# EAGLE design C2N-PowerV2 (EAGLE 5.11)
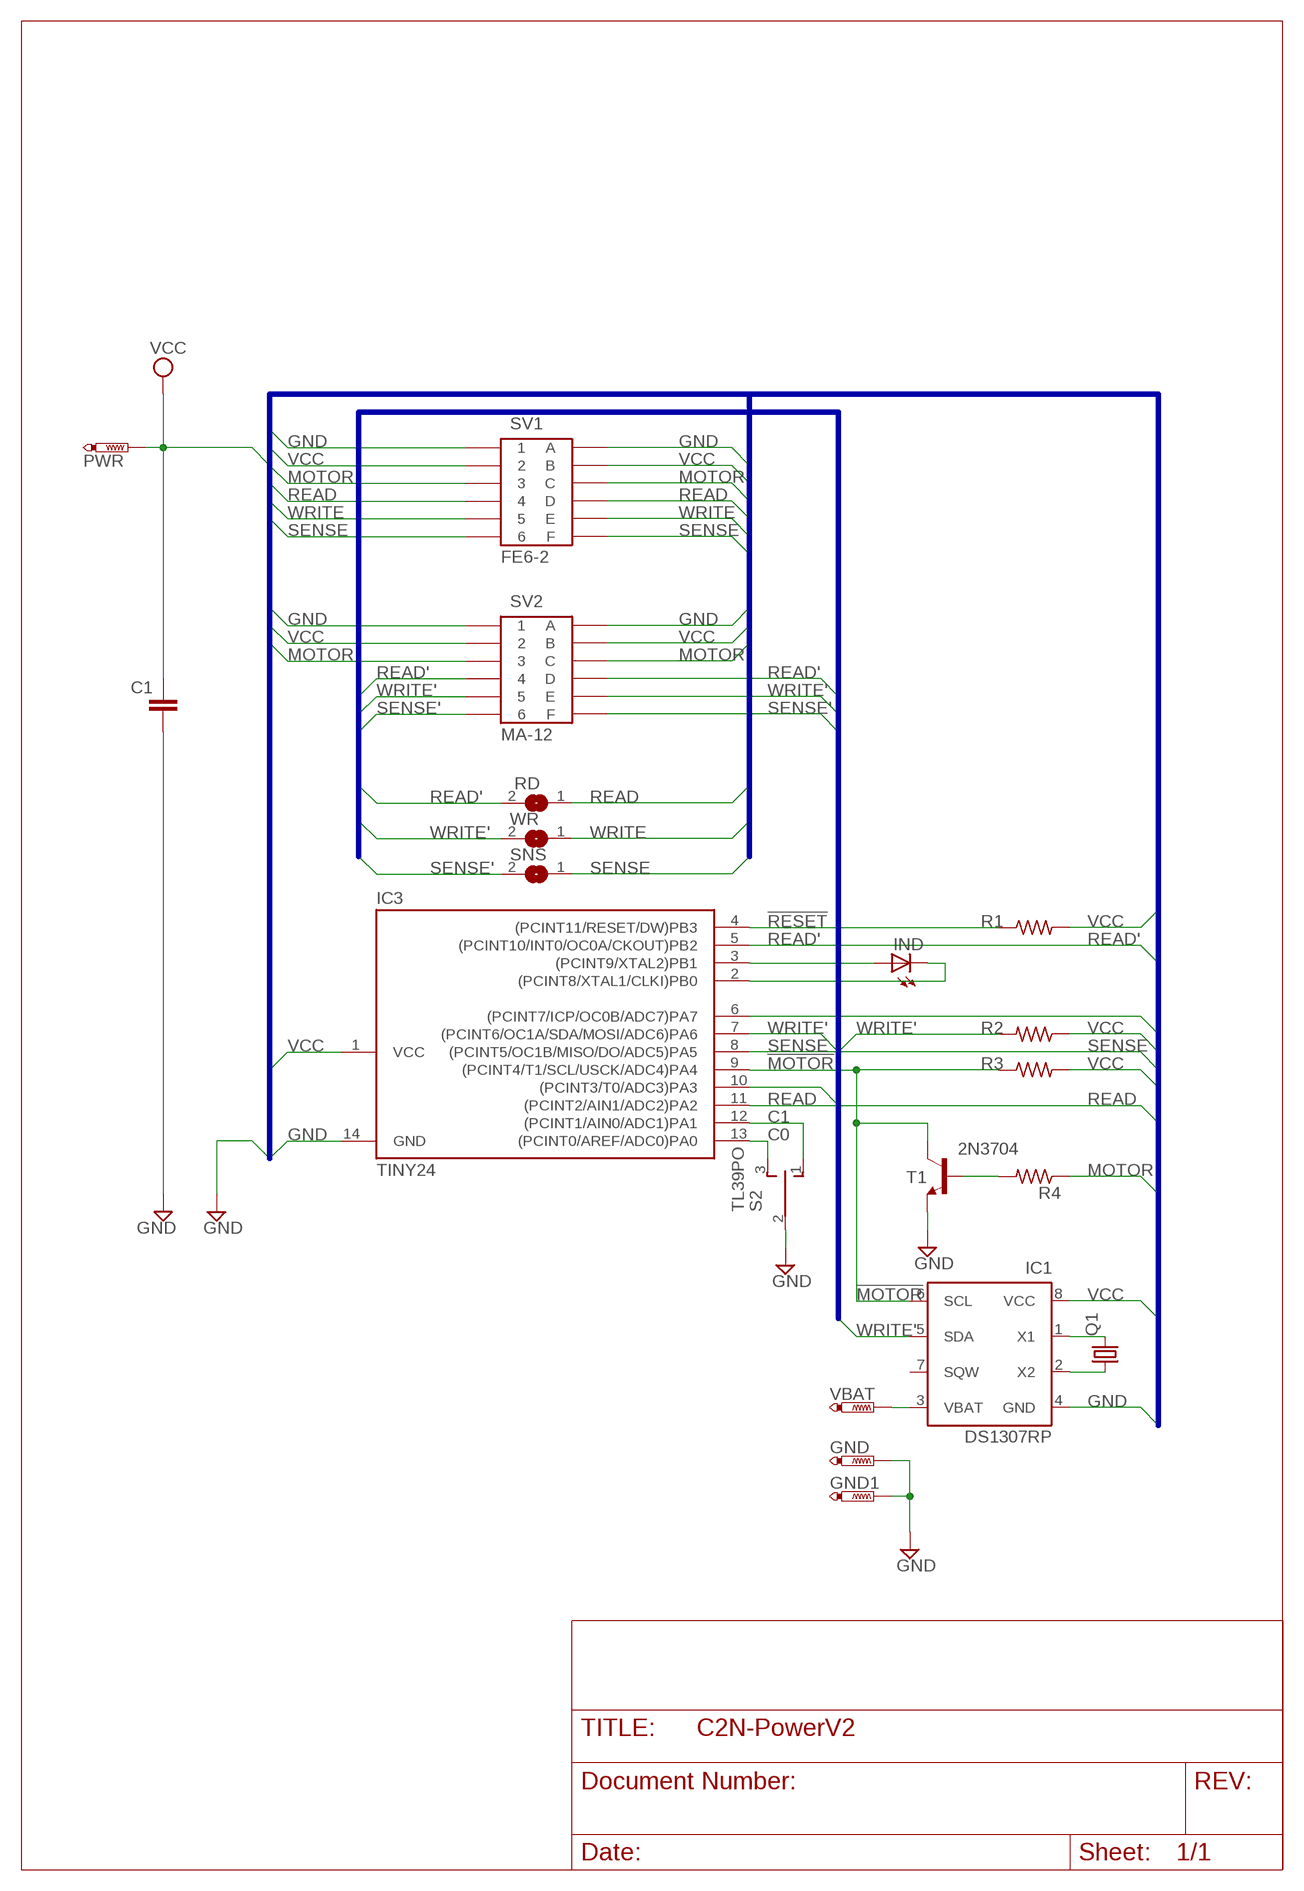
[diagram p0: schematic, sheet 1]

## Parts
C1  C2.5/2  [C2.5-2]
GND  PTR1TP10R  [TP10R]
GND1  PTR1TP10R  [TP10R]
IC1  DS1307RP  [DIL08-RP]
IC3  TINY24  TINY24/44/84-PU  [DIL14]
IND  LED3MM  [LED3MM]
PWR  PTR1PAD1-13  [P1-13]
Q1  CRYSTALTC26V  [TC26V]
R1  R-US_0204/2V  [0204V]
R2  R-US_0204/2V  [0204V]
R3  R-US_0204/2V  [0204V]
R4  R-US_0204/2V  [0204V]
RD  SJ  [SJ]
S2  TL39PO  [TL3XPO]
SNS  SJ  [SJ]
SV1  FE6-2  [FE6-2_SHORT]
SV2  MA-12  [MA-12]
T1  2N3704  [TO92]
VBAT  PTR1TP10R  [TP10R]
WR  SJ  [SJ]

## Nets
!MOTOR: IC1.6(SCL) IC3.9((PCINT4/T1/SCL/USCK/ADC4)PA4) R3.1 T1.2(C)
!RESET: IC3.4((PCINT11/RESET/DW)PB3) R1.1
C0: IC3.13((PCINT0/AREF/ADC0)PA0) S2.3(S)
C1: IC3.12((PCINT1/AIN0/ADC1)PA1) S2.1(O)
GND: C1.2 GND1.TP GND.TP IC1.4(GND) IC3.14(GND) S2.2(P) SV1.1 SV1.A SV2.1 SV2.A T1.3(E)
MOTOR: R4.1 SV1.3 SV1.C SV2.3 SV2.C
N$1: IC3.3((PCINT9/XTAL2)PB1) IND.A
N$3: IC3.2((PCINT8/XTAL1/CLKI)PB0) IND.K(C)
N$8: IC1.1(X1) Q1.2
N$9: IC1.2(X2) Q1.1
N$10: R4.2 T1.1(B)
READ: IC3.11((PCINT2/AIN1/ADC2)PA2) RD.1 SV1.4 SV1.D
READ': IC3.5((PCINT10/INT0/OC0A/CKOUT)PB2) RD.2 SV2.4 SV2.D
SENSE: IC3.8((PCINT5/OC1B/MISO/DO/ADC5)PA5) SNS.1 SV1.6 SV1.F
SENSE': IC3.10((PCINT3/T0/ADC3)PA3) SNS.2 SV2.6 SV2.F
VBAT: IC1.3(VBAT) VBAT.TP
VCC: C1.1 IC1.8(VCC) IC3.1(VCC) PWR.TP R1.2 R2.1 R3.2 SV1.2 SV1.B SV2.2 SV2.B
WRITE: IC3.6((PCINT7/ICP/OC0B/ADC7)PA7) SV1.5 SV1.E WR.1
WRITE': IC1.5(SDA) IC3.7((PCINT6/OC1A/SDA/MOSI/ADC6)PA6) R2.2 SV2.5 SV2.E WR.2
Unconnected: IC1.7(SQW)

## Buses
GND,VCC,MOTOR,SENSE,READ,WRITE
READ',WRITE',SENSE'

## Library data of the parts
C1 = capacitor-wima:C: CAPACITOR naming: grid - package width
GND GND1 PWR VBAT = testpad:PTR1: TEST PIN
IC1 = ds1307_pcf8583:DS1307: I2C-Bus CLOCK/CALENDAR
IC3 = avr-roundpad:TINY24/44/84
IND = led:LED: LED OSRAM: - CHIPLED LG R971, LG N971, LY N971, LG Q971, LY Q971, LO R971, LY R971 LH N974, LH R974 LS Q976, LO Q976, LY Q976 LO Q996 - Hyper CHIPLED LW Q18S LB Q993, LB Q99A, LB R99A - SideLED LS A670, LO A670, LY A670, LG A670, LP A670 LB A673, LV A673, LT A673, LW A673 LH A674 LY A675 LS A676, LA A676, LO A676, LY A676, LW A676 LS A679, LY A679, LG A679 - Hyper Micro SIDELED® LS Y876, LA Y876, LO Y876, LY Y876 LT Y87S - SmartLED LW L88C, LW L88S LB L89C, LB L89S, LG L890 LS L89K, LO L89K, LY L89K LS L896, LA L896, LO L896, LY L896 - TOPLED LS T670, LO T670, LY T670, LG T670, LP T670 LSG T670, LSP T670, LSY T670, LOP T670, LYG T670 LG T671, LOG T671, LSG T671 LB T673, LV T673, LT T673, LW T673 LH T674 LS T676, LA T676, LO T676, LY T676, LB T676, LH T676, LSB T676, LW T676 LB T67C, LV T67C, LT T67C, LS T67K, LO T67K, LY T67K, LW E67C LS E67B, LA E67B, LO E67B, LY E67B, LB E67C, LV E67C, LT E67C LW T67C LS T679, LY T679, LG T679 LS T770, LO T770, LY T770, LG T770, LP T770 LB T773, LV T773, LT T773, LW T773 LH T774 LS E675, LA E675, LY E675, LS T675 LS T776, LA T776, LO T776, LY T776, LB T776 LHGB T686 LT T68C, LB T68C - Hyper Mini TOPLED® LB M676 - Mini TOPLED Santana® LG M470 LS M47K, LO M47K, LY M47K Source: http://www.osram.convergy.de LUXEON: - LUMILED® LXK2-PW12-R00, LXK2-PW12-S00, LXK2-PW14-U00, LXK2-PW14-V00 LXK2-PM12-R00, LXK2-PM12-S00, LXK2-PM14-U00 LXK2-PE12-Q00, LXK2-PE12-R00, LXK2-PE12-S00, LXK2-PE14-T00, LXK2-PE14-U00 LXK2-PB12-K00, LXK2-PB12-L00, LXK2-PB12-M00, LXK2-PB14-N00, LXK2-PB14-P00, LXK2-PB14-Q00 LXK2-PR12-L00, LXK2-PR12-M00, LXK2-PR14-Q00, LXK2-PR14-R00 LXK2-PD12-Q00, LXK2-PD12-R00, LXK2-PD12-S00 LXK2-PH12-R00, LXK2-PH12-S00 LXK2-PL12-P00, LXK2-PL12-Q00, LXK2-PL12-R00 Source: www.luxeon.com KINGBRIGHT: KA-3528ASYC Source: www.kingbright.com
Q1 = crystal:CRYSTAL: CRYSTAL; OC_FARNELL: unknown; OC_NEWARK: unknown
R1-R4 = rcl:R-US_: RESISTOR, American symbol
RD SNS WR = jumper:SJ: SMD solder JUMPER
S2 = switch:TL39PO: TINY SWITCH ON OFF ON Source: http://www2.produktinfo.conrad.com/datenblaetter/700000-724999/705152-da-01-de-Subminiaturschalter_TL_36YO.pdf
SV1 = con-edge-156:FE6-2
SV2 = con-edge-156:MA-12
T1 = transistor:2N3704: NPN TRANSISTOR

## Board
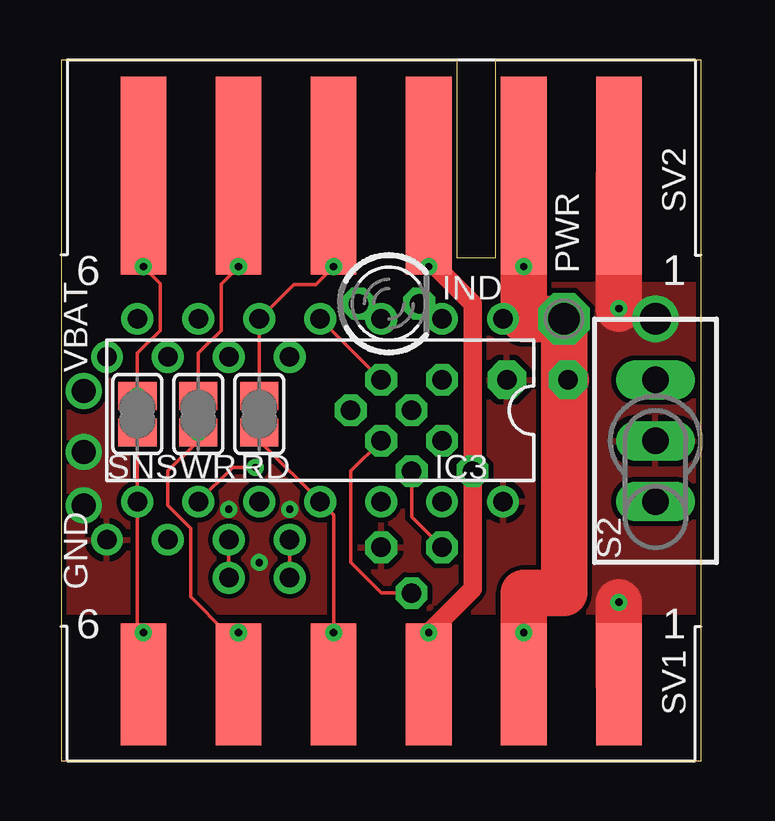
[diagram p1: board, top side]
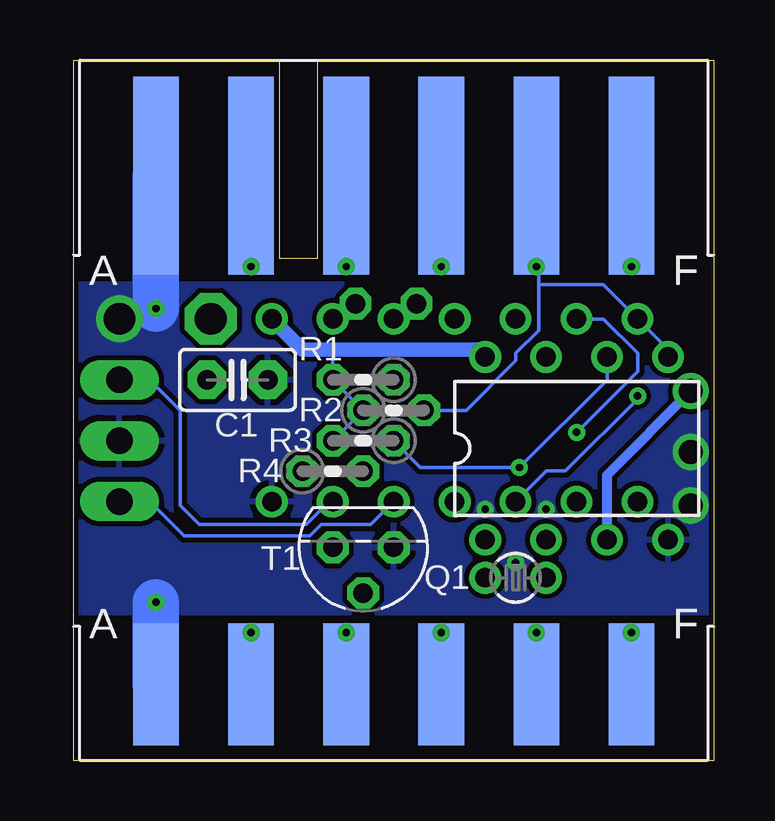
[diagram p2: board, bottom side, seen from below]

Size 26.67 x 29.21 mm. Coordinates in mm from the lower left corner, seen from the top.
Outline: 26.67,0 26.67,29.21 18.1,29.21 18.1,20.95 16.51,20.95 16.51,29.21 0,29.21 0.01,0 26.67,0
Copper layers (1*16): Top 0.035mm / dielectric 1.5mm / Bottom 0.035mm
Design rules "default *": minimum track width 4mil, minimum drill 12mil, track to track 8mil, track to pad 8mil, pad to pad 8mil, via to via 8mil, smd to smd 8mil, copper to edge 8mil, drill to drill 8mil, minimum pad ring 10mil, minimum via ring 8mil, stop-mask expansion 4mil, vias tented up to drill 0mil, thermal gap 10mil

### Footprints (pad centres in the part's own frame; a part is rotated, then mirrored left to right if it is on the bottom)
C2.5-2 = drill 0.813 pad 1.6 octagon: 1 -1.27,0; 2 1.27,0
TP10R = smd 1 x 1: TP 0,0
DIL08-RP = drill 0.813 round: 1 -3.81,-3.81; 2 -1.27,-3.81; 3 1.27,-3.81; 4 3.81,-3.81; 5 3.81,3.81; 6 1.27,3.81; 7 -1.27,3.81; 8 -3.81,3.81
DIL14 = drill 0.813 round: 1 -7.62,-3.81; 2 -5.08,-3.81; 3 -2.54,-3.81; 4 0,-3.81; 5 2.54,-3.81; 6 5.08,-3.81; 7 7.62,-3.81; 8 7.62,3.81; 9 5.08,3.81; 10 2.54,3.81; 11 0,3.81; 12 -2.54,3.81; 13 -5.08,3.81; 14 -7.62,3.81
LED3MM = drill 0.813 octagon: A -1.27,0; K 1.27,0
P1-13 = drill 1.321 pad 2.159 octagon: TP 0,0
TC26V = drill 0.813 round: 1 -1.27,0; 2 1.27,0
0204V = drill 0.813 octagon: 1 -1.27,0; 2 1.27,0
SJ = smd 1.168 x 1.6: 1 -0.762,0; 2 0.762,0
TL3XPO = drill 1.1 pad 1.422 long: 1 -2.54,0; 2 0,0; 3 2.54,0
FE6-2_SHORT = smd 1.905 x 5.08: 1 -9.906,0; 2 -5.944,0; 3 -1.981,0; 4 1.981,0; 5 5.944,0; 6 9.906,0 | smd 1.905 x 5.08 bottom: A -9.906,0; B -5.944,0; C -1.981,0; D 1.981,0; E 5.944,0; F 9.906,0
MA-12 = smd 1.905 x 8.255: 1 -9.906,-0.254; 2 -5.944,-0.254; 3 -1.981,-0.254; 4 1.981,-0.254; 5 5.944,-0.254; 6 9.906,-0.254 | smd 1.905 x 8.255 bottom: A -9.906,-0.254; B -5.944,-0.254; C -1.981,-0.254; D 1.981,-0.254; E 5.944,-0.254; F 9.906,-0.254
TO92 = drill 0.813 octagon: 1 1.27,0; 2 0,1.905; 3 -1.27,0

### Placement (x,y rotation side)
C1  19.84,15.87 0 bottom
GND  0.95,12.86 0 top
GND1  0.95,10.64 0 top
IC1  5.71,13.02 0 bottom
IC3  10.79,14.61 180 top
IND  13.65,19.05 0 top
PWR  20.96,18.41 90 top
Q1  8.26,7.62 180 bottom
R1  14.61,15.87 180 bottom
R2  13.33,14.6 0 bottom
R3  14.61,13.34 180 bottom
R4  15.88,12.06 0 bottom
RD  8.26,14.45 90 top
S2  24.77,13.34 90 top
SNS  3.17,14.45 90 top
SV1  13.34,3.17 180 top
SV2  13.34,24.13 180 top
T1  14.6,8.89 180 bottom
VBAT  0.95,15.4 0 top
WR  5.71,14.45 90 top

### Tracks (layer width: path | path; a pad name or v marks a point on that pad's centre or on a via)
!MOTOR  (via drill 0.3)
  Top 0.102: R3.1 | T1.2
  Top 0.152: R3.1 12.06,12.06 12.06,8.26 13.33,6.99 T1.2 | IC3.9 7.14,12.22 v8.1,12.22
  Bottom 0.152: R3.1 12.22,12.22 v8.1,12.22 4.44,15.88 IC1.6
!RESET
  Top 0.102: R1.1
  Top 0.152: IC3.4 R1.1
C0
  Bottom 0.152: S2.3 23.49,15.88 22.22,14.61 22.22,10.64 21.43,9.84 16.99,9.84 16.59,10.24 16.35,10.48 16.03,10.79 IC3.13
C1
  Bottom 0.102: IC3.12
  Bottom 0.152: IC3.12 14.29,9.84 16.35,9.84 16.83,9.37 22.07,9.37 23.49,10.79 S2.1
GND  (via drill 0.3, 1, 1.3)
  Top 1.93: SV1.1 v23.24,6.6 | v23.24,18.85 SV2.1
  Bottom 1.93: v23.24,6.6 SV1.1 | v23.24,18.85 SV2.1
  other vias: 0.95,12.86 0.95,10.64 24.76,18.41 8.25,8.26 6.98,10.48 9.52,10.48
  pour Bottom: 0,6.19 0,19.84 26.67,19.84 26.67,6.19
  pour Top: 0,6.19 0,19.84 26.67,19.84 26.67,6.19
MOTOR  (via drill 0.3)
  Top 0.102: v15.32,20.59 SV2.3
  Top 0.254: SV1.3 v15.32,5.33
  Top 0.61: 15.6,20.59 v15.32,20.59 | R4.1
  Top 0.762: v15.32,5.33 17.14,7.16 R4.1 17.14,19.05 15.6,20.59
  Bottom 0.102: v15.32,20.59 SV2.3
  Bottom 0.254: v15.32,5.33 SV1.3
N$1
  Bottom 0.152: IND.A 12.7,19.05 IC3.3
N$3
  Bottom 0.152: IND.K 15.24,19.05 IC3.2
N$8
  Top 0.152: IC1.1 Q1.2
N$9
  Top 0.152: IC1.2 Q1.1
N$10
  Top 0.152: R4.2 14.6,10.16 T1.1
READ  (via drill 0.3 pad 0.3)
  Top 0.102: 8.38,13.21 RD.1
  Top 0.152: SV1.4 v11.35,5.33 11.35,10.24 IC3.11 8.38,13.21
  Bottom 0.152: v11.35,5.33 SV1.4
READ'  (via drill 0.3)
  Top 0.102: SV2.4 | 8.25,16.83 IC3.5 8.25,16.83
  Top 0.152: RD.2 IC3.5 9.68,19.84 10.6,19.84 v11.35,20.59 SV2.4
  Bottom 0.152: SV2.4 11.35,20.43 v11.35,20.59
SENSE  (via drill 0.3)
  Top 0.152: SNS.1 IC3.8 3.17,5.59 v3.43,5.33 SV1.6
  Bottom 0.152: v3.43,5.33 SV1.6
SENSE'  (via drill 0.3)
  Top 0.102: v3.43,20.59 3.43,20.64 3.17,20.38 | SNS.2 3.17,14.73 SNS.2 | SNS.2 | SV2.6
  Top 0.152: 3.43,20.64 SV2.6 | v3.43,20.59 4.13,19.89 4.13,17.94 3.17,16.99 SNS.2
  Bottom 0.102: SNS.2 3.17,15.08 | SV2.6
  Bottom 0.152: v3.43,20.59 SV2.6 | IC3.10 6.98,12.06 6.19,12.06 3.17,15.08
  other vias: 3.17,15.21
VBAT  (via drill 1)
  Bottom 0.406: VBAT.TP 4.44,11.91 IC1.3
  other vias: 0.95,15.4
VCC  (via drill 0.3)
  Top 0.61: SV1.2 v19.28,5.33 | v19.28,20.59 SV2.2 | C1.1 20.95,15.88 | 19.28,18.41 IC3.1 | PWR.TP
  Top 1.778: 20.95,15.88 C1.1
  Top 1.93: v19.28,20.59 19.28,18.41 PWR.TP 20.95,15.88 20.95,6.99 19.28,6.99 v19.28,5.33
  Bottom 0.102: R1.2 | R1.2 | R3.2
  Bottom 0.152: R3.2 R2.1 R1.2 15.87,17.14
  Bottom 0.61: v19.28,5.33 SV1.2 | v19.28,20.59 SV2.2 | IC1.8 9.84,17.14 15.87,17.14 17.14,17.14 IC3.1 | IC3.1
WRITE  (via drill 0.3, 0.3 pad 0.3)
  Top 0.102: v7.39,5.33 v7.4,5.33 | 5.59,13.21 WR.1
  Top 0.152: SV1.5 v7.39,5.33 6.89,5.33 5.4,6.83 5.4,9.68 4.44,10.64 4.44,12.06 5.59,13.21
  Bottom 0.152: v7.39,5.33 SV1.5 | IC3.6 4.6,18.41 3.17,16.99 3.17,16.22 WR.1
  other vias: 5.71,13.68
WRITE'  (via drill 0.3)
  Top 0.102: SV2.5 | 5.71,14.73 WR.2
  Top 0.152: SV2.5 v7.39,20.59 6.67,19.87 6.67,17.94 5.71,16.99 5.71,14.73
  Bottom 0.102: SV2.5 | 7.3,20.5 v7.39,20.59 | IC3.7
  Bottom 0.152: v7.39,20.59 SV2.5 | R2.2 10.32,14.61 8.25,16.67 8.25,16.99 7.3,17.94 7.3,19.84 | IC1.5 1.9,17.14 IC3.7 4.6,19.84 7.3,19.84 | 7.3,19.84 7.3,20.5

### Text on the board
tValues: C2NPower! v2 | TOP | (c) 2010-12 RETRO Innovations